# Altium schematic sheet POWER_1.2.SchDoc
size A4
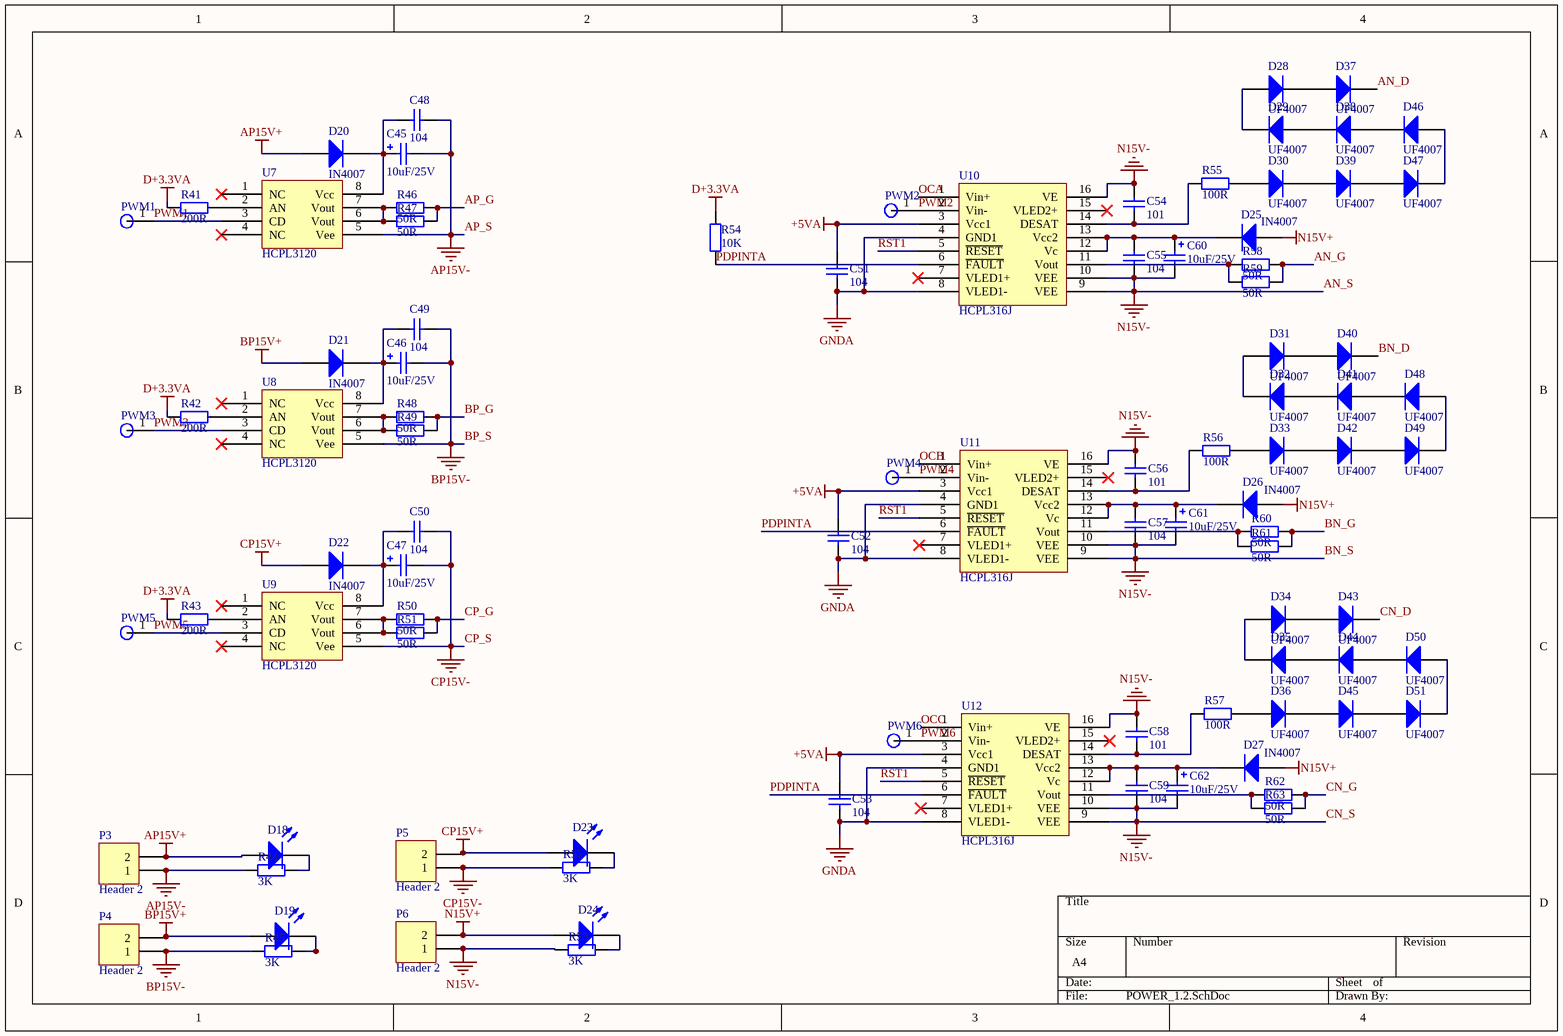
[diagram p0: POWER_1.2.SchDoc]

## Parts
C45  10uF/25V  [C_10UF/25V]
C46  10uF/25V  [C_10UF/25V]
C47  10uF/25V  [C_10UF/25V]
C48  104  [C2012-0805]
C49  104  [C2012-0805]
C50  104  [C2012-0805]
C51  104  [C2012-0805]
C52  104  [C2012-0805]
C53  104  [C2012-0805]
C54  101  [Rad-0.2]
C55  104  [C2012-0805]
C56  101  [Rad-0.2]
C57  104  [C2012-0805]
C58  101  [Rad-0.2]
C59  104  [C2012-0805]
C60  10uF/25V  [C_10UF/25V]
C61  10uF/25V  [C_10UF/25V]
C62  10uF/25V  [C_10UF/25V]
D18  (no value)  [LED-SMD]
D19  (no value)  [LED-SMD]
D20  IN4007  [DIODE4007]
D21  IN4007  [DIODE4007]
D22  IN4007  [DIODE4007]
D23  (no value)  [LED-SMD]
D24  (no value)  [LED-SMD]
D25  IN4007  [DIODE4007]
D26  IN4007  [DIODE4007]
D27  IN4007  [DIODE4007]
D28  UF4007  [DIODE4007]
D29  UF4007  [DIODE4007]
D30  UF4007  [DIODE4007]
D31  UF4007  [DIODE4007]
D32  UF4007  [DIODE4007]
D33  UF4007  [DIODE4007]
D34  UF4007  [DIODE4007]
D35  UF4007  [DIODE4007]
D36  UF4007  [DIODE4007]
D37  UF4007  [DIODE4007]
D38  UF4007  [DIODE4007]
D39  UF4007  [DIODE4007]
D40  UF4007  [DIODE4007]
D41  UF4007  [DIODE4007]
D42  UF4007  [DIODE4007]
D43  UF4007  [DIODE4007]
D44  UF4007  [DIODE4007]
D45  UF4007  [DIODE4007]
D46  UF4007  [DIODE4007]
D47  UF4007  [DIODE4007]
D48  UF4007  [DIODE4007]
D49  UF4007  [DIODE4007]
D50  UF4007  [DIODE4007]
D51  UF4007  [DIODE4007]
P3  Header 2  [HDR1X2]
P4  Header 2  [HDR1X2]
P5  Header 2  [HDR1X2]
P6  Header 2  [HDR1X2]
R41  200R  [R2012-0805]
R42  200R  [R2012-0805]
R43  200R  [R2012-0805]
R44  3K  [R2012-0805]
R45  3K  [R2012-0805]
R46  50R  [R2012-0805]
R47  50R  [R2012-0805]
R48  50R  [R2012-0805]
R49  50R  [R2012-0805]
R50  50R  [R2012-0805]
R51  50R  [R2012-0805]
R52  3K  [R2012-0805]
R53  3K  [R2012-0805]
R54  10K  [R2012-0805]
R55  100R  [R2012-0805]
R56  100R  [R2012-0805]
R57  100R  [R2012-0805]
R58  50R  [R2012-0805]
R59  50R  [R2012-0805]
R60  50R  [R2012-0805]
R61  50R  [R2012-0805]
R62  50R  [R2012-0805]
R63  50R  [R2012-0805]
T16  PWM2  [PIN1]
T17  PWM4  [PIN1]
T18  PWM6  [PIN1]
TP2  PWM1  [PIN1]
TP3  PWM3  [PIN1]
TP4  PWM5  [PIN1]
U7  HCPL3120  [HCPL3120]
U8  HCPL3120  [HCPL3120]
U9  HCPL3120  [HCPL3120]
U10  HCPL316J  [HCPL316J]
U11  HCPL316J  [HCPL316J]
U12  HCPL316J  [HCPL316J]

## Nets
+5VA: C51.2 C52.2 C53.2 U10.3(Vcc1) U11.3(Vcc1) U12.3(Vcc1)
AN_S: C54.2 C55.1 C56.2 C57.1 C58.2 C59.1 C60.2 C61.2 C62.2 P6.1 R53.1 U10.9(VEE) U10.10(VEE) U10.16(VE) U11.9(VEE) U11.10(VEE) U11.16(VE) U12.9(VEE) U12.10(VEE) U12.16(VE)  [also labelled BN_S, CN_S, N15V-]
AP15V+: D18.1(A) D20.1(A) P3.2
AP_S: C45.2 C48.2 P3.1 R44.1 U7.5(Vee)  [also labelled AP15V-]
BP15V+: D19.1(A) D21.1(A) P4.2
BP_S: C46.2 C49.2 P4.1 R45.1 U8.5(Vee)  [also labelled BP15V-]
CP15V+: D22.1(A) D23.1(A) P5.2
CP_S: C47.2 C50.2 P5.1 R52.1 U9.5(Vee)  [also labelled CP15V-]
D+3.3VA: R41.2 R42.2 R43.2 R54.2
GNDA: C51.1 C52.1 C53.1 U10.4(GND1) U10.8(VLED1-) U11.4(GND1) U11.8(VLED1-) U12.4(GND1) U12.8(VLED1-)
N15V+: D24.1(A) D25.1(A) D26.1(A) D27.1(A) P6.2
AN_D: D37.2(K)
AN_G: R58.1 R59.1
AP_G: R46.1 R47.1
BN_D: D40.2(K)
BN_G: R60.1 R61.1
BP_G: R48.1 R49.1
CN_D: D43.2(K)
CN_G: R62.1 R63.1
CP_G: R50.1 R51.1
OCA: U10.1(Vin+)
OCB: U11.1(Vin+)
OCC: U12.1(Vin+)
PDPINTA: R54.1 U10.6(~{FAULT}) U11.6(~{FAULT}) U12.6(~{FAULT})
PWM1: TP2.1(A) U7.3(CD)
PWM2: T16.1(A) U10.2(Vin-)
PWM3: TP3.1(A) U8.3(CD)
PWM4: T17.1(A) U11.2(Vin-)
PWM5: TP4.1(A) U9.3(CD)
PWM6: T18.1(A) U12.2(Vin-)
RST1: U10.5(~{RESET}) U11.5(~{RESET}) U12.5(~{RESET})
NetC45_1: C45.1 C48.1 D20.2(K) U7.8(Vcc)
NetC46_1: C46.1 C49.1 D21.2(K) U8.8(Vcc)
NetC47_1: C47.1 C50.1 D22.2(K) U9.8(Vcc)
NetC54_1: C54.1 R55.2 U10.14(DESAT)
NetC55_2: C55.2 C60.1 D25.2(K) U10.12(Vc) U10.13(Vcc2)
NetC56_1: C56.1 R56.2 U11.14(DESAT)
NetC57_2: C57.2 C61.1 D26.2(K) U11.12(Vc) U11.13(Vcc2)
NetC58_1: C58.1 R57.2 U12.14(DESAT)
NetC59_2: C59.2 C62.1 D27.2(K) U12.12(Vc) U12.13(Vcc2)
NetD18_2: D18.2(K) R44.2
NetD19_2: D19.2(K) R45.2
NetD23_2: D23.2(K) R52.2
NetD24_2: D24.2(K) R53.2
NetD28_1: D28.1(A) D29.2(K)
NetD28_2: D28.2(K) D37.1(A)
NetD29_1: D29.1(A) D38.2(K)
NetD30_1: D30.1(A) R55.1
NetD30_2: D30.2(K) D39.1(A)
NetD31_1: D31.1(A) D32.2(K)
NetD31_2: D31.2(K) D40.1(A)
NetD32_1: D32.1(A) D41.2(K)
NetD33_1: D33.1(A) R56.1
NetD33_2: D33.2(K) D42.1(A)
NetD34_1: D34.1(A) D35.2(K)
NetD34_2: D34.2(K) D43.1(A)
NetD35_1: D35.1(A) D44.2(K)
NetD36_1: D36.1(A) R57.1
NetD36_2: D36.2(K) D45.1(A)
NetD38_1: D38.1(A) D46.2(K)
NetD39_2: D39.2(K) D47.1(A)
NetD41_1: D41.1(A) D48.2(K)
NetD42_2: D42.2(K) D49.1(A)
NetD44_1: D44.1(A) D50.2(K)
NetD45_2: D45.2(K) D51.1(A)
NetD46_1: D46.1(A) D47.2(K)
NetD48_1: D48.1(A) D49.2(K)
NetD50_1: D50.1(A) D51.2(K)
NetR41_1: R41.1 U7.2(AN)
NetR42_1: R42.1 U8.2(AN)
NetR43_1: R43.1 U9.2(AN)
NetR46_2: R46.2 R47.2 U7.6(Vout) U7.7(Vout)
NetR48_2: R48.2 R49.2 U8.6(Vout) U8.7(Vout)
NetR50_2: R50.2 R51.2 U9.6(Vout) U9.7(Vout)
NetR58_2: R58.2 R59.2 U10.11(Vout)
NetR60_2: R60.2 R61.2 U11.11(Vout)
NetR62_2: R62.2 R63.2 U12.11(Vout)

Not connected (* = marked no-connect by the designer): U7 1(NC)* 4(NC)*; U8 1(NC)* 4(NC)*; U9 1(NC)* 4(NC)*; U10 7(VLED1+)* 15(VLED2+)*; U11 7(VLED1+)* 15(VLED2+)*; U12 7(VLED1+)* 15(VLED2+)*

## Library data of the parts
C45-C47 C60-C62 = Cap tan: 钽电解; value: 10uF/25V
C48-C59 = Cap: 普通电容
  C48-C53 C55 C57 C59: Value: 104
  C54 C56 C58: Value: 101
D18 D19 D23 D24 = LED
D20-D22 D25-D51 = Diode IN4007: 普通整流二极管
  D20-D22 D25-D27: value: IN4007
  D28-D51: value: UF4007
P3-P6 = Header 2: Header, 2-Pin; LatestRevisionDate: 17-Jul-2002; LatestRevisionNote: Re-released for DXP Platform.; Publisher: Altium Limited
R41-R63 = Res
  R41-R43: Value: 200R
  R44 R45 R52 R53: Value: 3K
  R46-R51 R58-R63: Value: 50R
  R54: Value: 10K
  R55-R57: Value: 100R
T16-T18 TP2-TP4 = TP: 测试脚